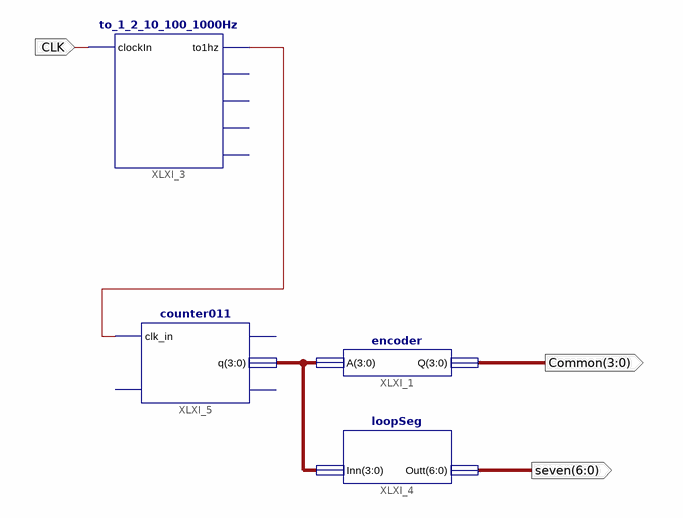
[diagram p0: schematic sheet 1]
// Xilinx ISE schematic main2.sch (spartan6) as structural Verilog: 4 symbols, 3 ports
module main2 (
  input  CLK,
  output [3:0] Common,
  output [6:0] seven
);

  wire XLXN_8;
  wire [3:0] XLXN_12;

  counter011 XLXI_5 (.clk_in(XLXN_8), .q(XLXN_12));  // open: clear, XLXN_20, divide_12
  to_1_2_10_100_1000Hz XLXI_3 (.clockIn(CLK), .to1hz(XLXN_8));  // open: to2hz, to10hz, to100hz, to1000hz
  encoder XLXI_1 (.A(XLXN_12), .Q(Common));
  loopSeg XLXI_4 (.Inn(XLXN_12), .Outt(seven));
endmodule
